# Altium schematic sheet SCH_System.SchDoc: System
size A4; Author: Melvin Tong; DrawnBy: Melvin Tong; Revision: v1.0; SheetNumber: 2; SheetTotal: 3
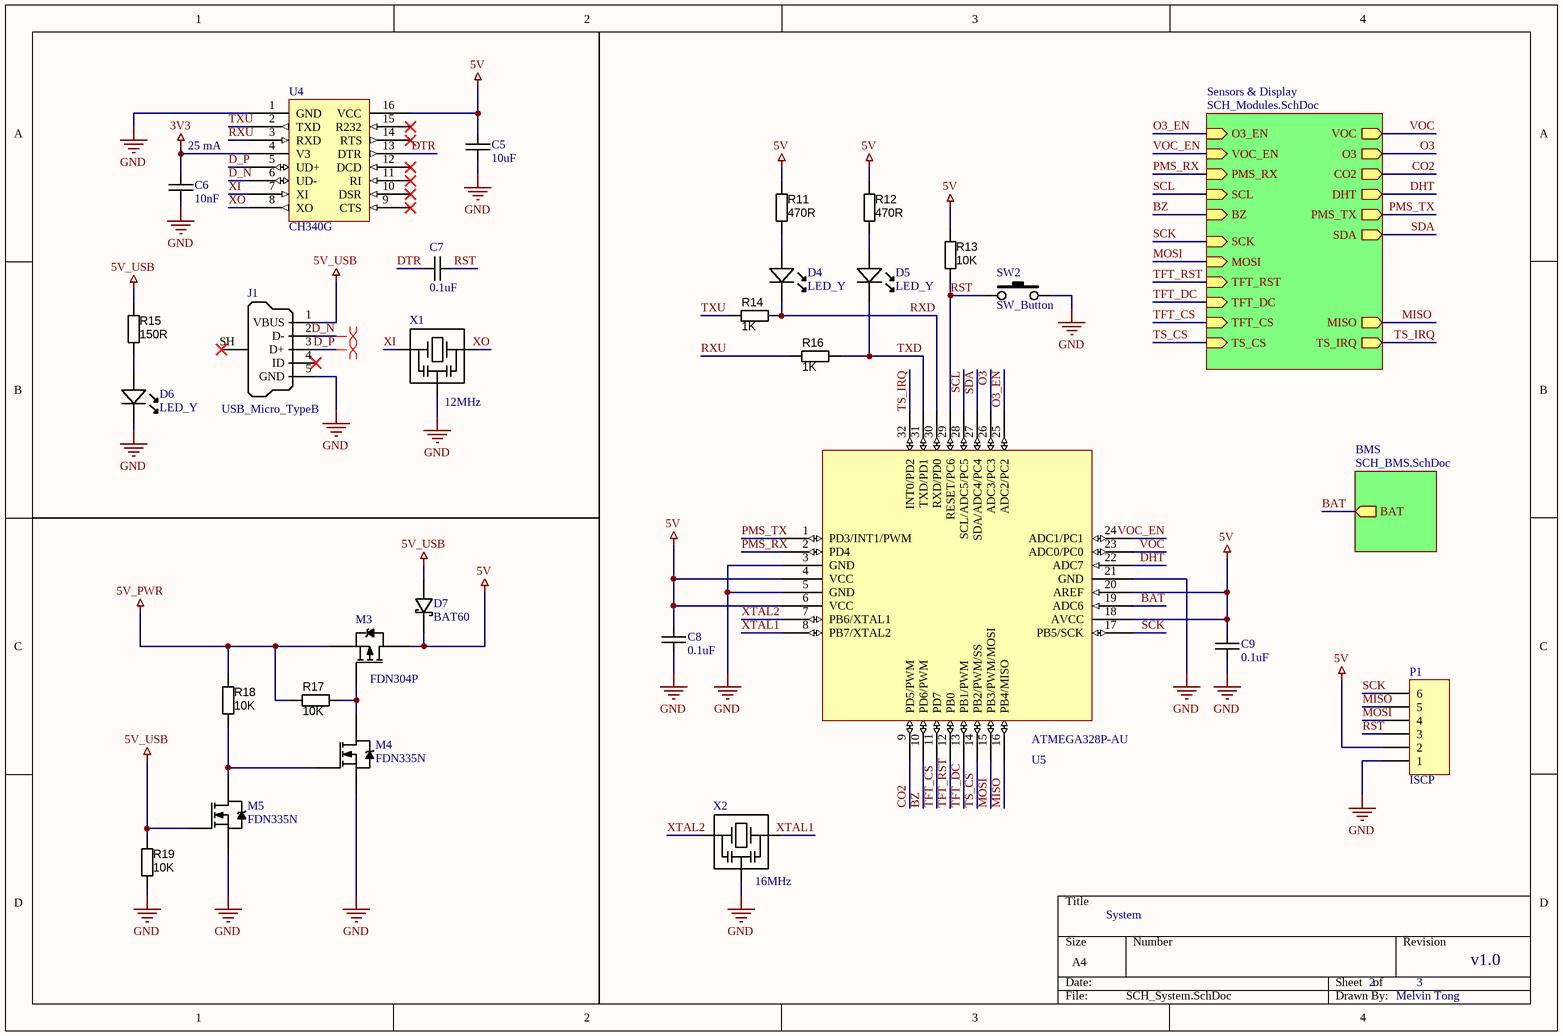
[diagram p0: SCH_System.SchDoc]

## Parts
C5  10uF  [CAP_0805]
C6  10nF  [CAP_0805]
C7  0.1uF  [CAP_0805]
C8  0.1uF  [CAP_0805]
C9  0.1uF  [CAP_0805]
D4  LED_Y  [LED_0805]
D5  LED_Y  [LED_0805]
D6  LED_Y  [LED_0805]
D7  BAT60  [SOD323]
J1  USB_Micro_TypeB  [USB_Micro_TypeB]
M3  FDN304P  [SOT23_213]
M4  FDN335N  [SOT23_213]
M5  FDN335N  [SOT23_213]
P1  ISCP  [HDR1X6]
R11  470R  [RESC3216X70N]
R12  470R  [RESC3216X70N]
R13  10K  [RESC3216X70N]
R14  1K  [RESC3216X70N]
R15  150R  [RESC3216X70N]
R16  1K  [RESC3216X70N]
R17  10K  [RESC3216X70N]
R18  10K  [RESC3216X70N]
R19  10K  [RESC3216X70N]
SW2  SW_Button  [Button_4x4x1.5]
U4  CH340G  [CH340G]
U5  ATMEGA328P-AU  [ATMEGA328P-AU]
X1  12MHz  [XTAL_3.2x1.6]
X2  16MHz  [XTAL_3.2x1.6]

## Sub-sheets
BMS = SCH_BMS.SchDoc: BAT (out)
Sensors & Display = SCH_Modules.SchDoc: CO2 (out), PMS_TX (out), PMS_RX (in), VOC (out), DHT (out), O3_EN (in), O3 (out), SDA (out), SCL (in), TFT_RST (in), TS_CS (in), TFT_DC (in), MOSI (in), TFT_CS (in), SCK (in), MISO (out), TS_IRQ (out), VOC_EN (in), BZ (in)

## Nets
3V3: C6.1 U4.4(V3)
5V: C5.1 C8.1 C9.1 D7.K M3.3(D) P1.2 R11.2 R12.1 R13.1 U4.16(VCC) U5.4(VCC) U5.6(VCC) U5.18(AVCC) U5.20(AREF)
5V_PWR: M3.2(S) R17.1 R18.1
5V_USB: D7.A J1.1(VBUS) M5.1(G) R15.1 R19.1
GND: C5.2 C6.2 C8.2 C9.2 D6.K J1.5(GND) M4.2(S) M5.2(S) P1.1 R19.2 SW2.2 U4.1(GND) U5.3(GND) U5.5(GND) U5.21(GND) X1.2(GND) X2.2(GND)
BAT: U5.19(ADC6) ; sheet BMS/BAT
BZ: U5.10(PD6/PWM) ; sheet Sensors & Display/BZ
CO2: U5.9(PD5/PWM) ; sheet Sensors & Display/CO2
D_N: J1.2(D-) U4.6(UD-)
D_P: J1.3(D+) U4.5(UD+)
DHT: U5.22(ADC7) ; sheet Sensors & Display/DHT
DTR: C7.1 U4.13(DTR)
MISO: P1.5 U5.16(PB4/MISO) ; sheet Sensors & Display/MISO
MOSI: P1.4 U5.15(PB3/PWM/MOSI) ; sheet Sensors & Display/MOSI
O3: U5.26(ADC3/PC3) ; sheet Sensors & Display/O3
O3_EN: U5.25(ADC2/PC2) ; sheet Sensors & Display/O3_EN
PMS_RX: U5.2(PD4) ; sheet Sensors & Display/PMS_RX
PMS_TX: U5.1(PD3/INT1/PWM) ; sheet Sensors & Display/PMS_TX
RST: C7.2 P1.3 R13.2 SW2.1 U5.29(RESET/PC6)
RXD: D4.K R14.2 U5.30(RXD/PD0)
RXU: R16.1 U4.3(RXD)
SCK: P1.6 U5.17(PB5/SCK) ; sheet Sensors & Display/SCK
SCL: U5.28(SCL/ADC5/PC5) ; sheet Sensors & Display/SCL
SDA: U5.27(SDA/ADC4/PC4) ; sheet Sensors & Display/SDA
TFT_CS: U5.11(PD7) ; sheet Sensors & Display/TFT_CS
TFT_DC: U5.13(PB1/PWM) ; sheet Sensors & Display/TFT_DC
TFT_RST: U5.12(PB0) ; sheet Sensors & Display/TFT_RST
TS_CS: U5.14(PB2/PWM/SS) ; sheet Sensors & Display/TS_CS
TS_IRQ: U5.32(INT0/PD2) ; sheet Sensors & Display/TS_IRQ
TXD: D5.K R16.2 U5.31(TXD/PD1)
TXU: R14.1 U4.2(TXD)
VOC: U5.23(ADC0/PC0) ; sheet Sensors & Display/VOC
VOC_EN: U5.24(ADC1/PC1) ; sheet Sensors & Display/VOC_EN
XI: U4.7(XI) X1.1(IN)
XO: U4.8(XO) X1.3(OUT)
XTAL1: U5.8(PB7/XTAL2) X2.3(OUT)
XTAL2: U5.7(PB6/XTAL1) X2.1(IN)
NetD4_A: D4.A R11.1
NetD5_A: D5.A R12.2
NetD6_A: D6.A R15.2
NetM3_1: M3.1(G) M4.3(D) R17.2
NetM4_1: M4.1(G) M5.3(D) R18.2

Not connected (* = marked no-connect by the designer): J1 4(ID)* SH(Shell)*; U4 9(CTS)* 10(DSR)* 11(RI)* 12(DCD)* 14(RTS)* 15(R232)*

## Layout directives
differential pair: D_N, D_P

## Notes on the sheet
- (near C6) 25 mA

## Library data of the parts
C5 = CAP_10uF: SMD 0805
C6 = CAP_10nF: SMD 0805
C7-C9 = CAP_0.1uF: SMD 0805
D4-D6 = LED_Y: SMD_0805 2.4V
D7 = BAT60: Schottky Diode 3A, Vf~0.24V, Vr=10V
M3 = PMOS
M4 M5 = NMOS
P1 = Header 6: Header, 6-Pin; LatestRevisionDate: 17-Jul-2002; LatestRevisionNote: Re-released for DXP Platform.; Publisher: Altium Limited
R11 R12 = RES_470R: Resistor SMD, 1206; Value: N/A
R13 R17-R19 = RES_10K: Resistor SMD, 1206; Value: N/A
R14 R16 = RES_1K: Resistor SMD, 1206; Value: N/A
R15 = RES_150R: Resistor SMD, 1206; Value: N/A
X1 = 12MHz: Crystal Oscillator
X2 = 16MHz: Crystal Oscillator